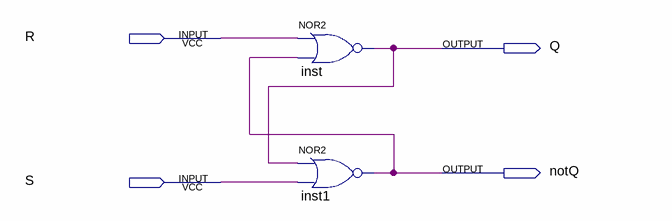
[diagram p0: schematic sheet]
// Quartus schematic SR_latch_block.bdf as structural Verilog: 2 symbols, 4 pins
module SR_latch_block (
  input  R,
  input  S,
  output Q,
  output notQ
);

  nor inst (Q, R, notQ);
  nor inst1 (notQ, Q, S);
endmodule
